# Altium schematic sheet CRSC0001.SchDoc: Crtical System Computer-Top level
size A3; Author: Sam Shan Jiang; DrawnBy: Sam Shan Jiang; Engineer: Sam Shan Jiang; DocumentNumber: CRSC0001; SheetNumber: 1; SheetTotal: 5; Description: The top level overview of the entire critical system computer; Version: 1.0
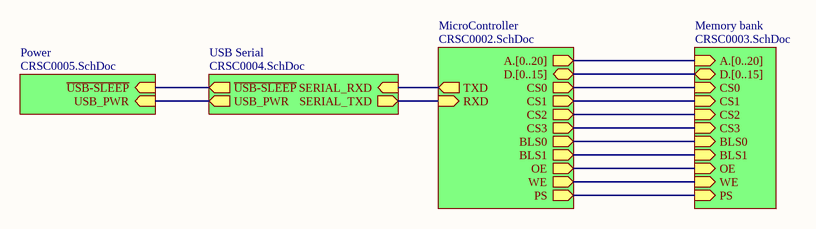
[diagram p0: CRSC0001.SchDoc]

## Sub-sheets
Memory bank = CRSC0003.SchDoc: A.[0..20] (in), D.[0..15] (bidir), OE (in), WE (in), PS (in), CS0 (in), CS1 (in), BLS0 (in), BLS1 (in), CS2 (in), CS3 (in)
MicroController = CRSC0002.SchDoc: A.[0..20] (out), D.[0..15] (bidir), CS0 (out), CS1 (out), OE (out), WE (out), BLS0 (out), BLS1 (out), PS (out), RXD (in), TXD (out), CS2 (out), CS3 (out)
Power = CRSC0005.SchDoc: ~{USB-SLEEP} (in), USB_PWR (in)
USB Serial = CRSC0004.SchDoc: ~{USB-SLEEP} (out), USB_PWR (out), SERIAL_RXD (in), SERIAL_TXD (out)

## Nets
(unnamed): sheet MicroController/CS0, sheet Memory bank/CS0
(unnamed): sheet MicroController/CS1, sheet Memory bank/CS1
(unnamed): sheet MicroController/OE, sheet Memory bank/OE
(unnamed): sheet MicroController/WE, sheet Memory bank/WE
(unnamed): sheet MicroController/BLS0, sheet Memory bank/BLS0
(unnamed): sheet MicroController/BLS1, sheet Memory bank/BLS1
(unnamed): sheet MicroController/PS, sheet Memory bank/PS
(unnamed): sheet MicroController/RXD, sheet USB Serial/SERIAL_TXD
(unnamed): sheet MicroController/TXD, sheet USB Serial/SERIAL_RXD
(unnamed): sheet MicroController/CS2, sheet Memory bank/CS2
(unnamed): sheet MicroController/CS3, sheet Memory bank/CS3
(unnamed): sheet USB Serial/~{USB-SLEEP}, sheet Power/~{USB-SLEEP}
(unnamed): sheet USB Serial/USB_PWR, sheet Power/USB_PWR

## Buses and harness runs
bus sheet Memory bank/A.[0..20] = sheet MicroController/A.[0..20]
bus sheet Memory bank/D.[0..15] = sheet MicroController/D.[0..15]

## Notes on the sheet
- Title
- Description:
- Size:
- Author:
- Date:
- A3
- Time:
- Version
- Sheet:
- Drawing No.:
- of
- File: